# EAGLE schematic expenasion_board_template (EAGLE 6.6.0)
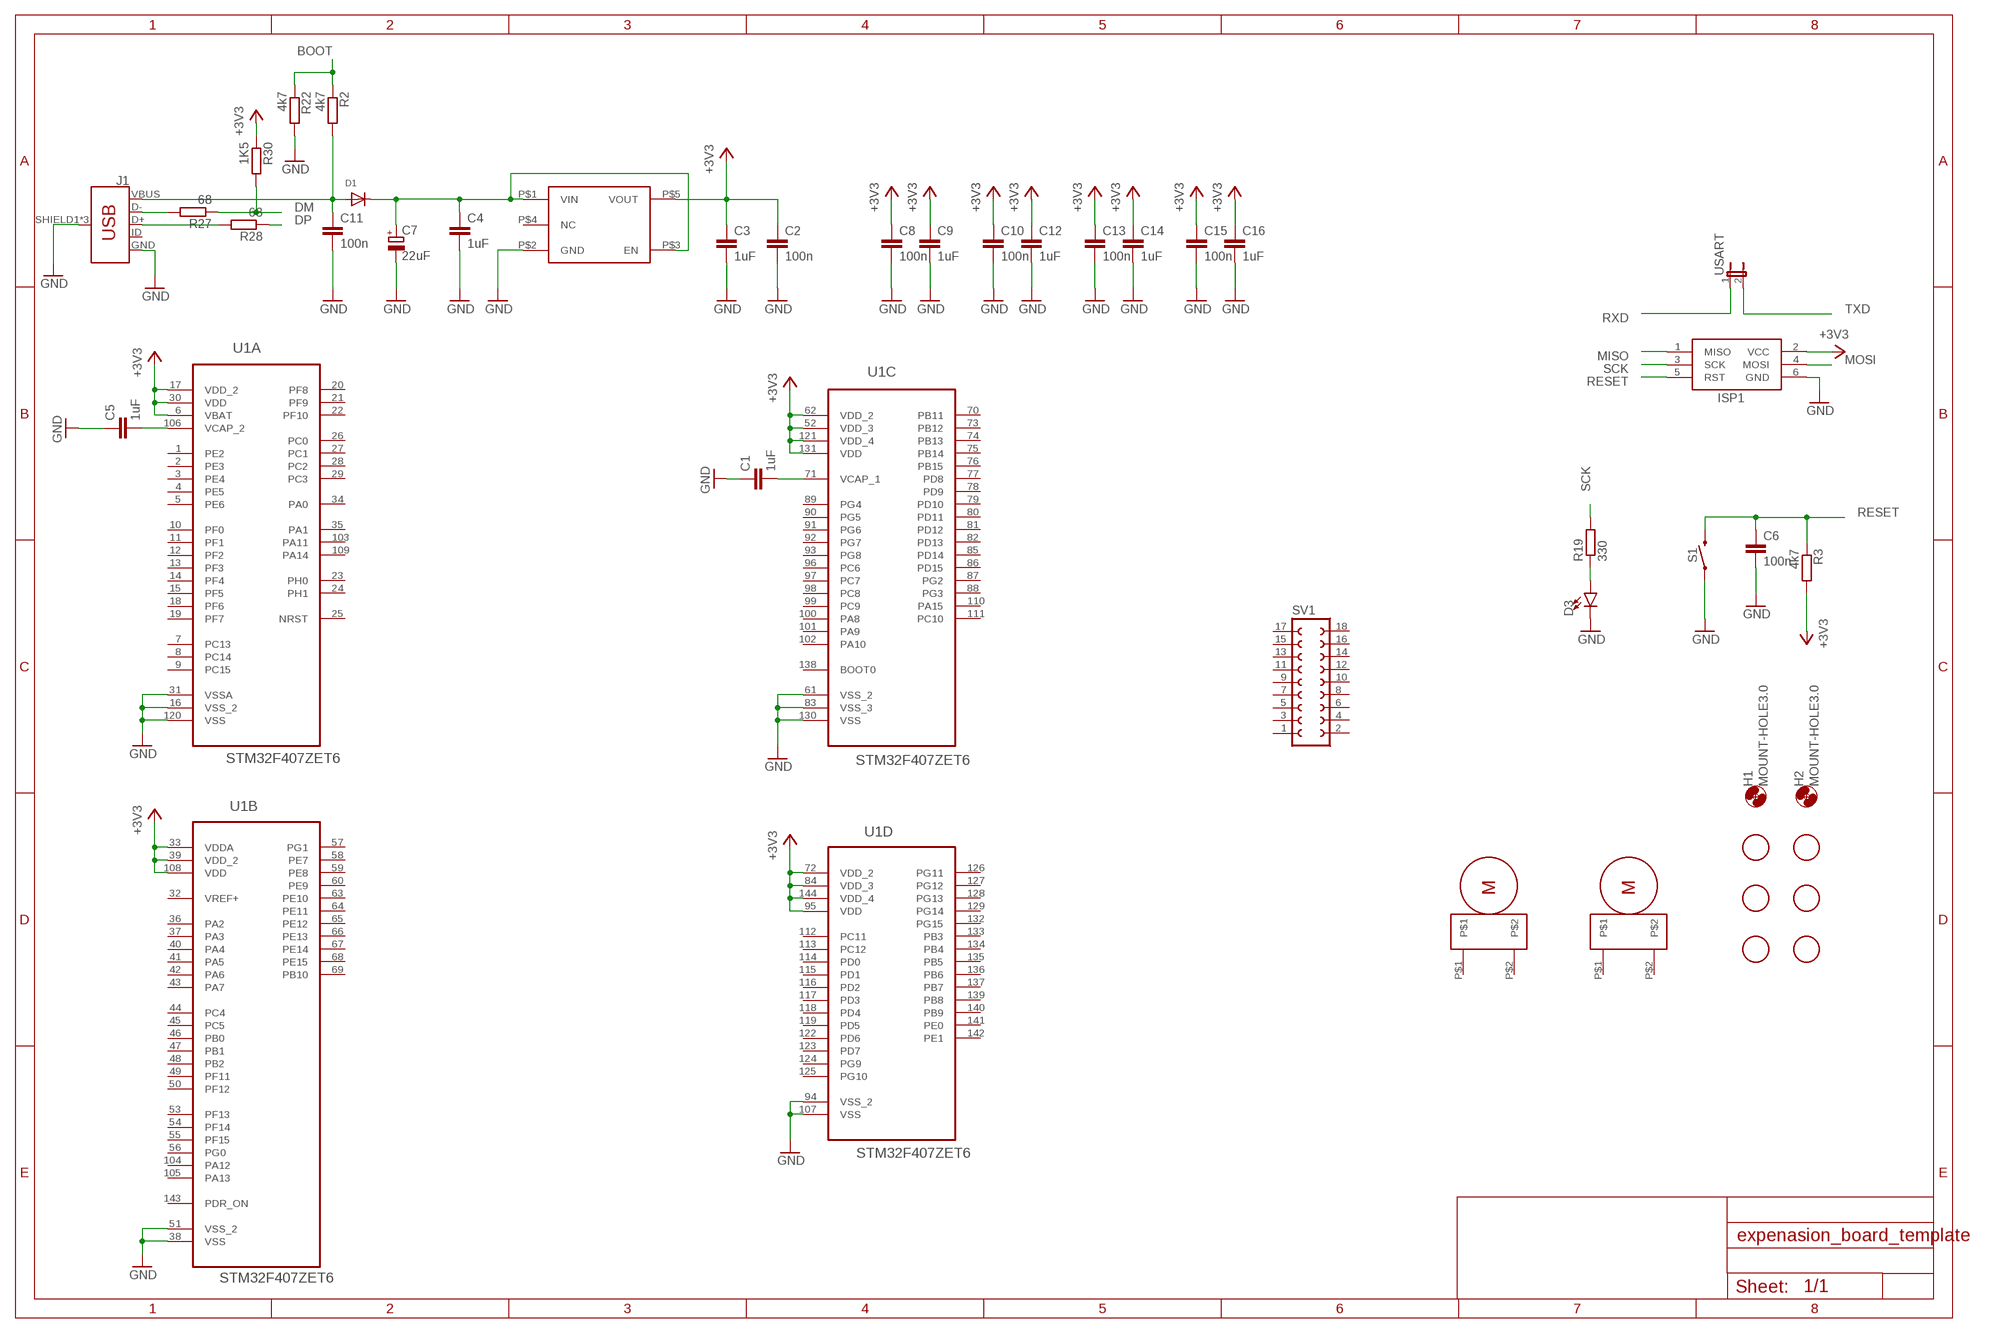
[diagram p0: schematic, sheet 1]

## Parts
C1  1uF  C-EUC0805  [C0805]
C2  100n  C-EUC0603  [C0603]
C3  1uF  C-EUC0805  [C0805]
C4  1uF  C-EUC0805  [C0805]
C5  1uF  C-EUC0805  [C0805]
C6  100n  C-EUC0603  [C0603]
C7  22uF  CPOL-EU153CLV-0505  [153CLV-0505]
C8  100n  C-EUC0603  [C0603]
C9  1uF  C-EUC0805  [C0805]
C10  100n  C-EUC0603  [C0603]
C11  100n  C-EUC0603  [C0603]
C12  1uF  C-EUC0805  [C0805]
C13  100n  C-EUC0603  [C0603]
C14  1uF  C-EUC0805  [C0805]
C15  100n  C-EUC0603  [C0603]
C16  1uF  C-EUC0805  [C0805]
D1  DIODE_SOD-123FL  [SOD-123FL]
D3  LED-FKIT-1206  [FKIT-LED-1206]
H1  MOUNT-HOLE3.0  [3,0]
H2  MOUNT-HOLE3.0  [3,0]
ISP1  AVRISP-6  [AVRISP]
J1  USB_MICRO-B_FEMALE-SMT  [USB-B-MICRO-SMD]
R2  4k7  R-EU_R0603  [R0603]
R3  4k7  R-EU_R0603  [R0603]
R19  330  R-EU_R0603  [R0603]
R22  4k7  R-EU_R0603  [R0603]
R27  68  R-EU_R0603  [R0603]
R28  68  R-EU_R0603  [R0603]
R30  1K5  R-EU_R0603  [R0603]
S1  MOMENTARY-SWITCH-SPST-SMD-6.2MM-TALL  [TACTILE_SWITCH_SMD_6.2MM_TALL]
SV1  FE09-2  [FE09-2]
U1  STM32F407ZET6  [QFP50P2000X2000X160-144N]
U$1  FIDUCIAL  [FIDUCIAL_1MM]
U$2  PLANETARY_GEAR_MOTOR  [PLANETARY_GEAR_MOTOR]
U$3  FIDUCIAL  [FIDUCIAL_1MM]
U$4  FIDUCIAL  [FIDUCIAL_1MM]
U$5  FIDUCIAL  [FIDUCIAL_1MM]
U$6  FIDUCIAL  [FIDUCIAL_1MM]
U$7  FIDUCIAL  [FIDUCIAL_1MM]
U$10  PLANETARY_GEAR_MOTOR  [PLANETARY_GEAR_MOTOR]
U$11  MIC5504-3.3Y  [SOT23-5]
USART  JP1E  [JP1]

## Nets
+3V3: C2.1 C3.1 C8.1 C9.1 C10.1 C12.1 C13.1 C14.1 C15.1 C16.1 ISP1.2(VCC) R3.2 R30.1 U1.6(A:VBAT) U1.17(A:VDD_2) U1.30(A:VDD) U1.33(B:VDDA) U1.39(B:VDD_2) U1.52(C:VDD_3) U1.62(C:VDD_2) U1.72(D:VDD_2) U1.84(D:VDD_3) U1.95(D:VDD) U1.108(B:VDD) U1.121(C:VDD_4) U1.131(C:VDD) U1.144(D:VDD_4) U$11.P$5(VOUT)
BOOT: R2.1 R22.1
DM: R27.1 R30.2
DP: R28.1
GND: C1.1 C2.2 C3.2 C4.2 C5.1 C6.2 C7.- C8.2 C9.2 C10.2 C11.2 C12.2 C13.2 C14.2 C15.2 C16.2 D3.C ISP1.6(GND) J1.GND J1.SHIELD1(SHIELD) J1.SHIELD2(SHIELD) J1.SHIELD3(SHIELD) R22.2 S1.A2 U1.16(A:VSS_2) U1.31(A:VSSA) U1.38(B:VSS) U1.51(B:VSS_2) U1.61(C:VSS_2) U1.83(C:VSS_3) U1.94(D:VSS_2) U1.107(D:VSS) U1.120(A:VSS) U1.130(C:VSS) U$11.P$2(GND)
MISO: ISP1.1(MISO)
MOSI: ISP1.4(MOSI)
N$1: C1.2 U1.71(C:VCAP_1)
N$2: C5.2 U1.106(A:VCAP_2)
N$5: C11.1 D1.A J1.VBUS R2.2
N$9: C4.1 C7.+ D1.C U$11.P$1(VIN) U$11.P$3(EN)
N$19: D3.A R19.1
N$23: J1.D- R27.2
N$24: J1.D+ R28.2
RESET: C6.1 ISP1.5(RST) R3.1 S1.B2
RXD: USART.1
SCK: ISP1.3(SCK) R19.2
TXD: USART.2
Unconnected: J1.ID SV1.1 SV1.2 SV1.3 SV1.4 SV1.5 SV1.6 SV1.7 SV1.8 SV1.9 SV1.10 SV1.11 SV1.12 SV1.13 SV1.14 SV1.15 SV1.16 SV1.17 SV1.18 U1.1(A:PE2) U1.2(A:PE3) U1.3(A:PE4) U1.4(A:PE5) U1.5(A:PE6) U1.7(A:PC13) U1.8(A:PC14) U1.9(A:PC15) U1.10(A:PF0) U1.11(A:PF1) U1.12(A:PF2) U1.13(A:PF3) U1.14(A:PF4) U1.15(A:PF5) U1.18(A:PF6) U1.19(A:PF7) U1.20(A:PF8) U1.21(A:PF9) U1.22(A:PF10) U1.23(A:PH0) U1.24(A:PH1) U1.25(A:NRST) U1.26(A:PC0) U1.27(A:PC1) U1.28(A:PC2) U1.29(A:PC3) U1.34(A:PA0) U1.35(A:PA1) U1.36(B:PA2) U1.37(B:PA3) U1.40(B:PA4) U1.41(B:PA5) U1.42(B:PA6) U1.43(B:PA7) U1.44(B:PC4) U1.45(B:PC5) U1.46(B:PB0) U1.47(B:PB1) U1.48(B:PB2) U1.49(B:PF11) U1.50(B:PF12) U1.53(B:PF13) U1.54(B:PF14) U1.55(B:PF15) U1.56(B:PG0) U1.57(B:PG1) U1.58(B:PE7) U1.59(B:PE8) U1.60(B:PE9) U1.63(B:PE10) U1.64(B:PE11) U1.65(B:PE12) U1.66(B:PE13) U1.67(B:PE14) U1.68(B:PE15) U1.69(B:PB10) U1.70(C:PB11) U1.73(C:PB12) U1.74(C:PB13) U1.75(C:PB14) U1.76(C:PB15) U1.77(C:PD8) U1.78(C:PD9) U1.79(C:PD10) U1.80(C:PD11) U1.81(C:PD12) U1.82(C:PD13) U1.85(C:PD14) U1.86(C:PD15) U1.87(C:PG2) U1.88(C:PG3) U1.89(C:PG4) U1.90(C:PG5) U1.91(C:PG6) U1.92(C:PG7) U1.93(C:PG8) U1.96(C:PC6) U1.97(C:PC7) U1.98(C:PC8) U1.99(C:PC9) U1.100(C:PA8) U1.101(C:PA9) U1.102(C:PA10) U1.103(A:PA11) U1.104(B:PA12) U1.105(B:PA13) U1.109(A:PA14) U1.110(C:PA15) U1.111(C:PC10) U1.112(D:PC11) U1.113(D:PC12) U1.114(D:PD0) U1.115(D:PD1) U1.116(D:PD2) U1.117(D:PD3) U1.118(D:PD4) U1.119(D:PD5) U1.122(D:PD6) U1.123(D:PD7) U1.124(D:PG9) U1.125(D:PG10) U1.126(D:PG11) U1.127(D:PG12) U1.128(D:PG13) U1.129(D:PG14) U1.132(D:PG15) U1.133(D:PB3) U1.134(D:PB4) U1.135(D:PB5) U1.136(D:PB6) U1.137(D:PB7) U1.138(C:BOOT0) U1.139(D:PB8) U1.140(D:PB9) U1.141(D:PE0) U1.142(D:PE1) U1.143(B:PDR_ON) U$2.P$1 U$2.P$2 U$10.P$1 U$10.P$2 U$11.P$4(NC)

## Power pins joined to a net without a drawn wire
VREF+: U1.32(B:VREF+)

## Library data of the parts
C1-C6 C8-C16 = resistor:C-EU: CAPACITOR, European symbol
C7 = resistor:CPOL-EU: POLARIZED CAPACITOR, European symbol
D1 = adafruit:DIODE: Diode SMADIODE - SMA Surface Mount Package 20V 1A Schottky Diode Digikey: 641-1014-6-ND DO-1N4148 - Through Hole Small Current Diode SOD-123 20V 1 A (.5mV Vf) Schottky Diode - Digikey: MBRX120TPMSCT-ND SOD-323 10V 570mA (.38mV Vf, 3ns) Schottky Diode - Digikey: ZLLS410CT-ND SOD-523 30V 30mA Schottky Diode (RB751S-40TE61) - Digikey: RB751S-40TE61CT-ND SOT23-R/W - SOT23 Package (R = Solder Paste/Reflow Ovens, W = Hand-Soldering) BAT54Film 40V 300mA - Digikey: 497-7162-1-ND
D3 = SparkFun-LED:LED: LED (Generic) Standard schematic elements and footprints for 5mm, 3mm, 1206, and 0603 sized LEDs. Generic LEDs with no color specified.
H1 H2 = holes:MOUNT-HOLE: MOUNTING HOLE with drill center marker
ISP1 = adafruit:AVRISP: AVR ISP HEADER Standard 6 pin header for AVR programming
J1 = SparkFun-Connectors:USB_MICRO-B: USB Type Micro-B Connector Male/female and PTH/SMT variants SparkFun Products: SparkFun microB USB Breakout <https://www.sparkfun.com/products/12035> SparkFun USB microB Plug Breakout <https://www.sparkfun.com/products/10031> SparkFun ESP8266 Thing <https://www.sparkfun.com/products/13231>; PROD_ID: CONN-11752
R2 R3 R19 R22 R27 R28 R30 = resistor:R-EU_: RESISTOR, European symbol
S1 = SparkFun-Switches:MOMENTARY-SWITCH-SPST: Momentary Switch (Pushbutton) - SPST Normally-open (NO) SPST momentary switches (buttons, pushbuttons). Variants PTH-12MM - 12mm square, through-hole Momentary Pushbutton Switch - 12mm Square <https://www.sparkfun.com/products/9190> (COM-09190) PTH-6.0MM, PTH-6.0MM-KIT - 6.0mm square, through-hole Mini Pushbutton Switch <https://www.sparkfun.com/products/97> (COM-00097) KIT package intended for soldering kit's - only one side of pads' copper is exposed. PTH-RIGHT-ANGLE-KIT - Right-angle, through-hole Right Angle Tactile Button <https://www.sparkfun.com/products/10791> - Used on SparkFun BigTime Watch Kit <https://www.sparkfun.com/products/11734> SMD-12MM - 12mm square, surface-mount Tactile Button - SMD (12mm) <https://www.sparkfun.com/products/12993> (COM-12993) Used on SparkFun PicoBoard <https://www.sparkfun.com/products/11888> SMD-4.5MM - 4.5mm Square Trackball Switch Used on SparkFun Blackberry Trackballer Breakout <https://www.sparkfun.com/products/13169> SMD-4.6MMX2.8MM - 4.60mm x 2.80mm, surface mount Used on SparkFun SAMD21 Mini Breakout <https://www.sparkfun.com/products/13664> SMD-5.2MM, SMD-5.2-REDUNDANT - 5.2mm square, surface-mount Mini Pushbutton Switch - SMD <https://www.sparkfun.com/products/8720> (COM-08720) Used on Arduino Pro Mini <https://www.sparkfun.com/products/11114> REDUNDANT package connects both switch circuits together SMD-6.0X3.5MM - 6.0 x 3.5mm, surface mount Momentary Reset Switch SMD <https://www.sparkfun.com/products/8229> (COM-08229) SMD-6.2MM-TALL - 6.2mm square, surface mount Tactile Button - SMD (6mm) <https://www.sparkfun.com/products/12992> Used on SparkFun Digital Sandbox <https://www.sparkfun.com/products/12651> SMD-RIGHT-ANGLE - Right-angle, surface mount Used on SparkFun Block for Intel® Edison - Arduino <https://www.sparkfun.com/products/13036>; PROD_ID: SWCH-11966; SF_SKU: COM-12992
SV1 = con-lsta:FE09-2: FEMALE HEADER; OC_FARNELL: unknown; OC_NEWARK: unknown
U1 = stm32:STM32F407ZET6: ARM Cortex-M4 32b MCU+FPU, 144 LQFP; MPN: STM32F407ZET6; OC_FARNELL: 2215229; OC_NEWARK: 46W2203; PACKAGE: LQFP-144; SUPPLIER: STMICROELECTRONICS
U$1 U$3-U$7 = adafruit:FIDUCIAL: For use by pick and place machines to calibrate the vision/machine, 1mm By microbuilder.eu
U$2 U$10 = my_parts:PLANETARY_GEAR_MOTOR
U$11 = my_parts:MIC5504-3.3Y
USART = jumper:JP1E: JUMPER